# EAGLE schematic crawler_esp12 (EAGLE 8.1.0)
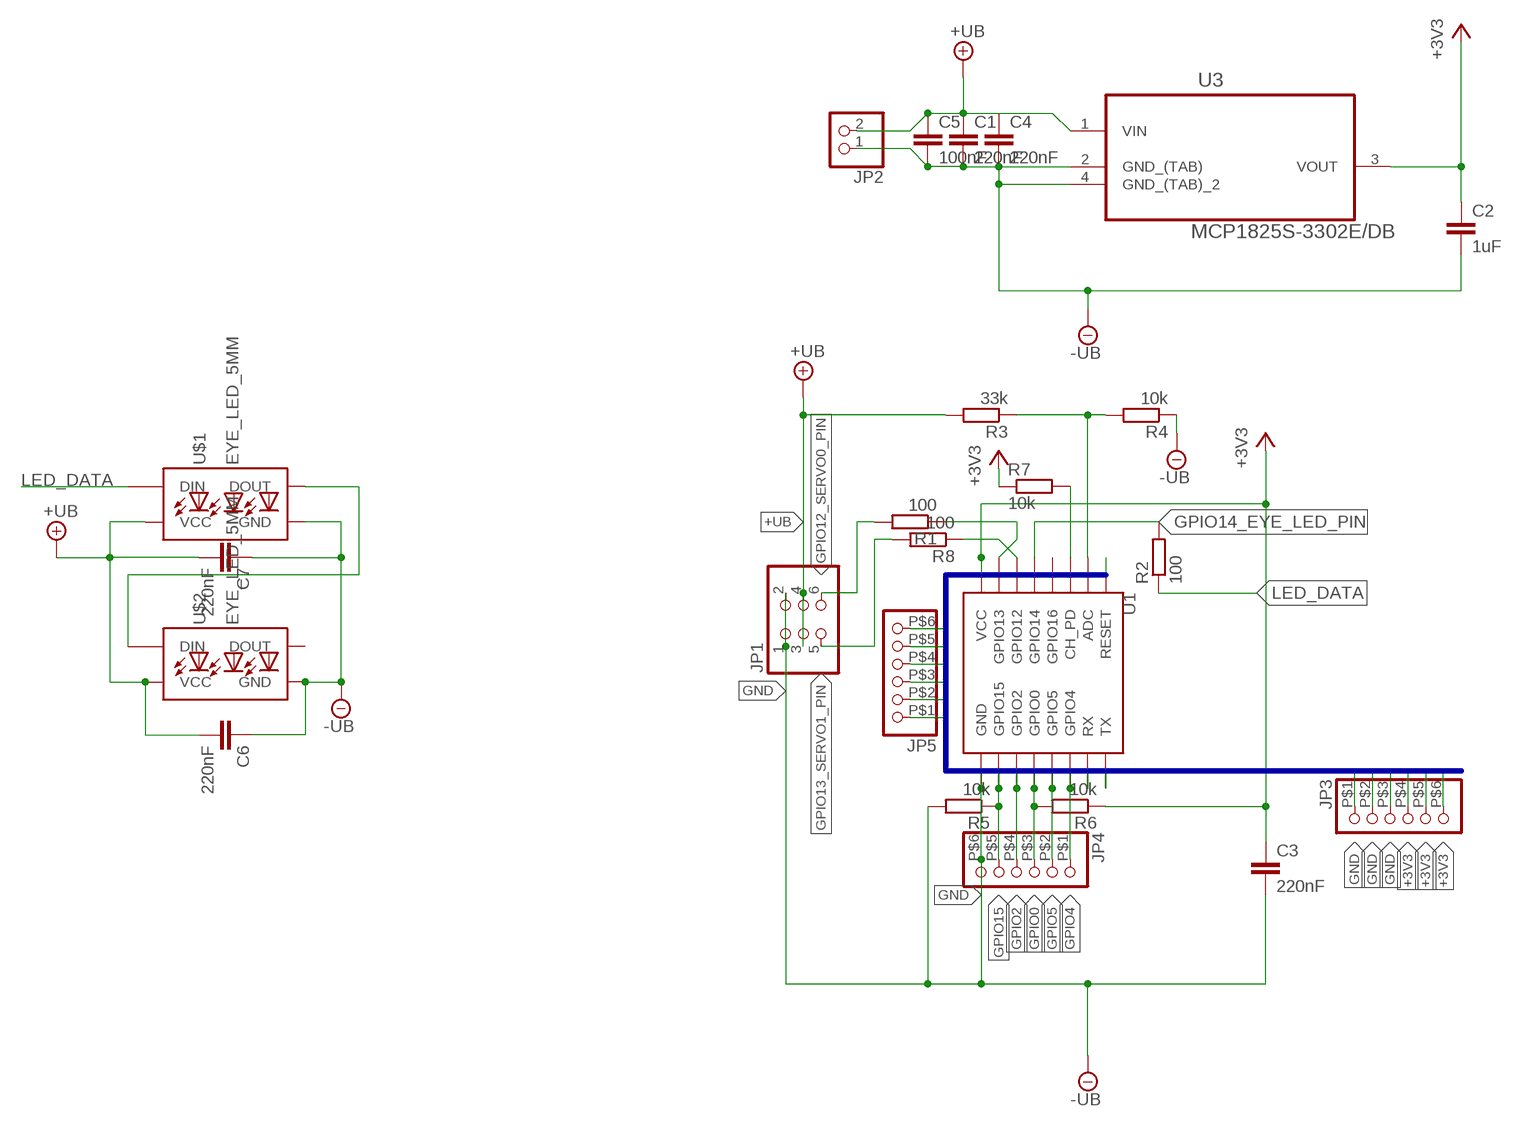
[diagram p0: schematic, sheet 1]

## Parts
C1  220nF  C-EUC0805  [C0805]
C2  1uF  C-EUC0805  [C0805]
C3  220nF  C-EUC0805  [C0805]
C4  220nF  C-EUC0805  [C0805]
C5  100nF  C-EUC0805  [C0805]
C6  220nF  C-EUC0805  [C0805]
C7  220nF  C-EUC0805  [C0805]
JP1  PINHD-2X3  [2X03]
JP2  PINHD-1X2  [1X02]
JP3  PINHD-1X6SMD  [1X06/90_SMD]
JP4  PINHD-1X6SMD  [1X06/90_SMD]
JP5  PINHD-1X6SMD  [1X06/90_SMD]
R1  100  R-EU_R0805  [R0805]
R2  100  R-EU_R0805  [R0805]
R3  33k  R-EU_R0805  [R0805]
R4  10k  R-EU_R0805  [R0805]
R5  10k  R-EU_R0805  [R0805]
R6  10k  R-EU_R0805  [R0805]
R7  10k  R-EU_R0805  [R0805]
R8  100  R-EU_R0805  [R0805]
U1  ESP12SMD  [ESP12-SMD]
U3  MCP1825S-3302E/DB  [SOT230P700X180-4N]
U$1  EYE_LED_5MM  [EYE_LED_5MM]
U$2  EYE_LED_5MM  [EYE_LED_5MM]

## Nets
+3V3: C2.1 C3.1 JP3.P$4 JP3.P$5 JP3.P$6 JP5.P$1 R6.1 R7.1 U1.VCC U3.3(VOUT)
+UB: C1.1 C4.1 C5.1 C6.2 C7.2 JP1.3 JP1.4 JP2.2 R3.2 U3.1(VIN) U$1.5V(VCC) U$2.5V(VCC)
ADC: R3.1 R4.2 U1.ADC
ENABLE: R7.2 U1.CH_PD
GND: C1.2 C2.2 C3.2 C4.2 C5.2 C6.1 C7.1 JP1.1 JP1.2 JP2.1 JP3.P$1 JP3.P$2 JP3.P$3 JP4.P$6 JP5.P$6 R4.1 R5.2 U1.GND U3.2(GND_(TAB)) U3.4(GND_(TAB)_2) U$1.GND U$2.GND ; supply symbol labelled -UB
GPIO0: JP4.P$3 JP5.P$2 R6.2 U1.GPIO0
GPIO2: JP4.P$4 U1.GPIO2
GPIO4: JP4.P$1 U1.GPIO4
GPIO5: JP4.P$2 U1.GPIO5
GPIO12_SERVO0_PIN: JP1.6 R1.2
GPIO13_SERVO1_PIN: JP1.5 R8.2
GPIO14_EYE_LED_PIN: R2.2 U1.GPIO14
GPIO15: JP4.P$5 R5.1 U1.GPIO15
LED_DATA: R2.1 U$1.DIN
N$1: U$1.DOUT U$2.DIN
N$2: R1.1 U1.GPIO13
N$3: R8.1 U1.GPIO12
RESET: JP5.P$5 U1.RESET
RX: JP5.P$4 U1.RXD0(RX)
TX: JP5.P$3 U1.TXD0(TX)
Unconnected: U1.GPIO16 U$2.DOUT

## Buses
GND,+3V3,RESET,RX,TX,GPIO0,GPIO15,GPIO2,GPIO5,GPIO4

## Library data of the parts
C1-C7 = rcl:C-EU: CAPACITOR, European symbol
JP1 = pinhead:PINHD-2X3: PIN HEADER
JP2 = pinhead:PINHD-1X2: PIN HEADER
JP3-JP5 = pinhead:PINHD-1X6: PIN HEADER
R1-R8 = rcl:R-EU_: RESISTOR, European symbol
U1 = esp8266modules:ESP12: ESP8266 Wifi module 12
U3 = crawler_esp12:MCP1825S-3302E/DB: IC, LDO VOLT REG, 3.3V, 0.5A; MPN: MCP1825S-3302E/DB; OC_FARNELL: 1578404; OC_NEWARK: 26M9961; PACKAGE: SOT-223-3; SUPPLIER: Microchip
U$1 U$2 = crawler_esp12:EYE_LED_5MM